# EAGLE schematic frets-main-board2 (EAGLE 6.6.0)
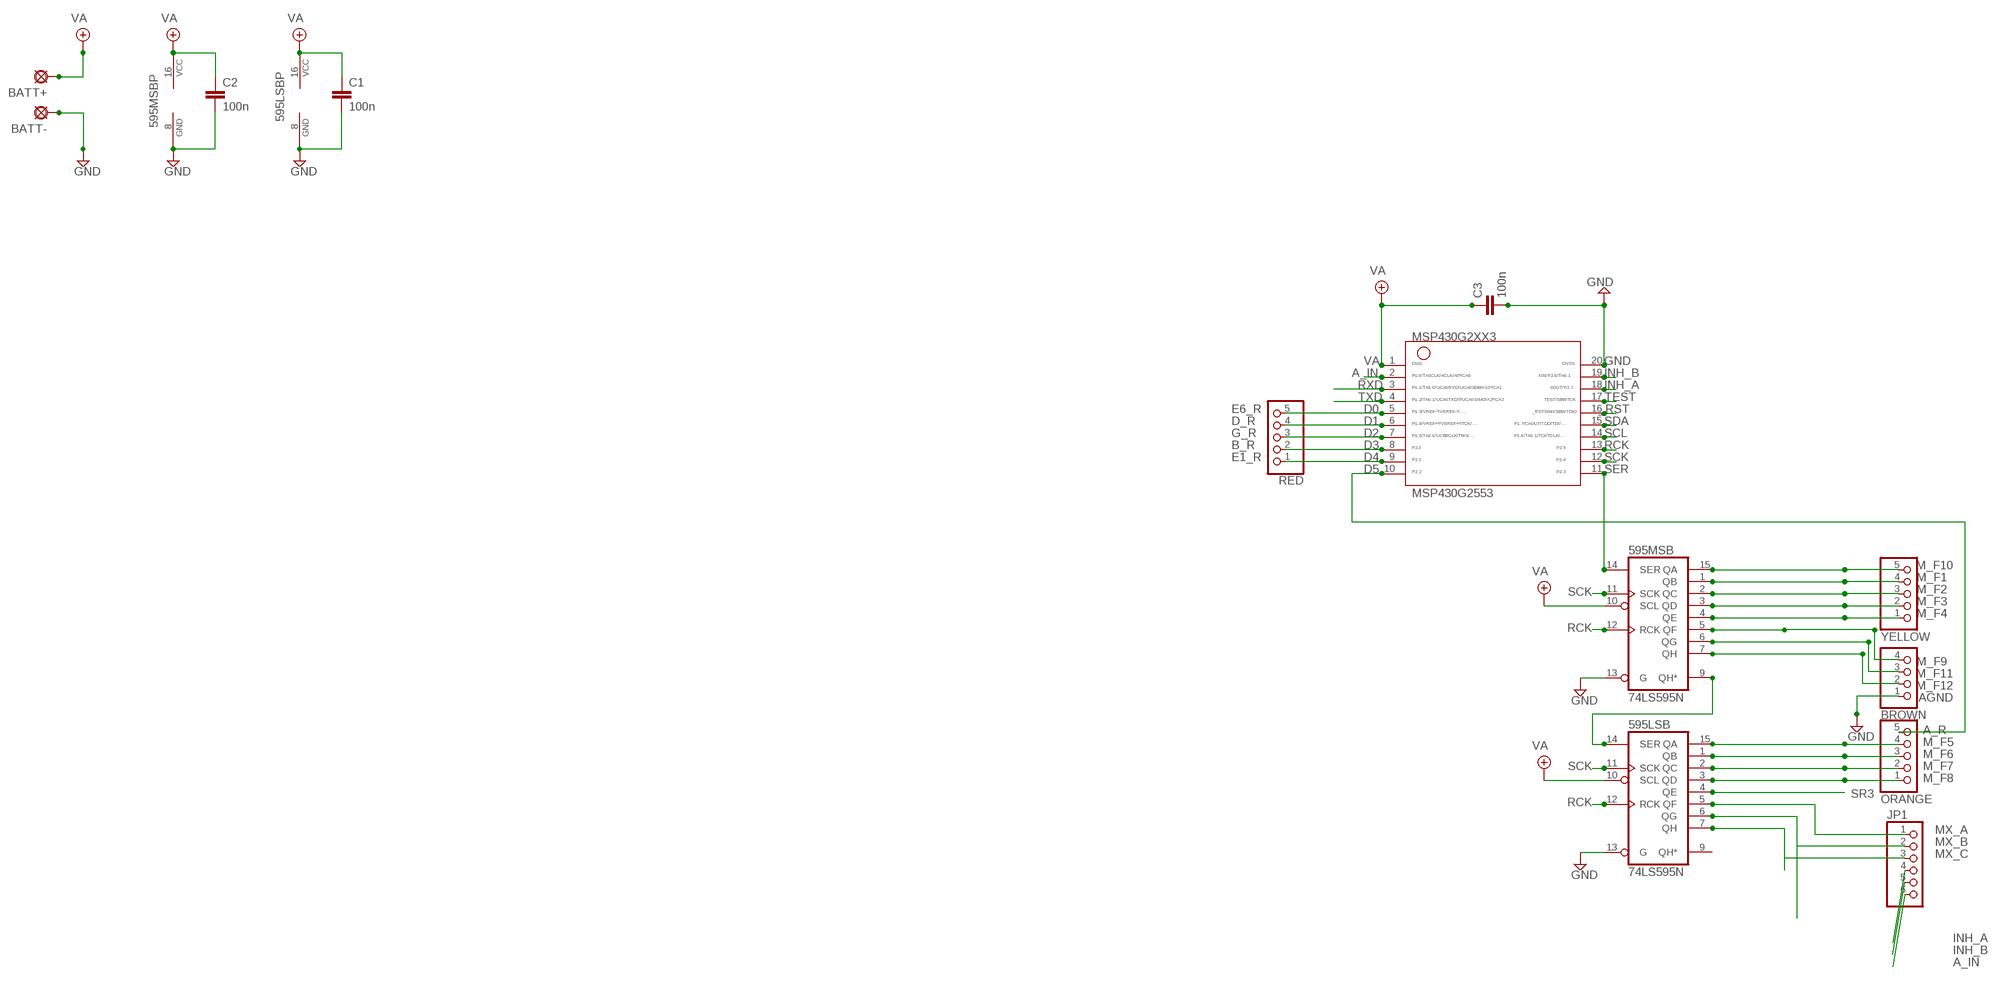
[diagram p0: schematic, sheet 1]

## Parts
595LSB  74LS595N  [DIL16]
595MSB  74LS595N  [DIL16]
BATT+  PADL  [LONG]
BATT-  PADL  [LONG]
BROWN  PINHD-1X4  [1X04]
C1  100n  050X030_050  [050X030_050_3]
C2  100n  050X030_050  [050X030_050_3]
C3  100n  050X030_050  [050X030_050_3]
JP1  PINHD-1X6  [1X06]
MSP430G2553  G2XX3---N20  [N20]
ORANGE  PINHD-1X5  [1X05]
RED  PINHD-1X5  [1X05]
YELLOW  PINHD-1X5  [1X05]

## Nets
_RST: MSP430G2553.16
A_IN: JP1.6 MSP430G2553.2
D0: MSP430G2553.5 RED.5
D1: MSP430G2553.6 RED.4
D2: MSP430G2553.7 RED.3
D3: MSP430G2553.8 RED.2
D4: MSP430G2553.9 RED.1
D5: MSP430G2553.10 ORANGE.5
GND: 595LSB.8(GND) 595LSB.13(G) 595MSB.8(GND) 595MSB.13(G) BATT-.1(PAD) BROWN.1 C1.2 C2.2 C3.2 MSP430G2553.20
INH_A: JP1.4 MSP430G2553.18
INH_B: JP1.5 MSP430G2553.19
MX_A: 595LSB.5(QF) JP1.1
MX_B: 595LSB.6(QG) JP1.2
MX_C: 595LSB.7(QH) JP1.3
N$1: 595LSB.14(SER) 595MSB.9(QH*)
RCK: 595LSB.12(RCK) 595MSB.12(RCK) MSP430G2553.13
RXD: MSP430G2553.3
SCK: 595LSB.11(SCK) 595MSB.11(SCK) MSP430G2553.12
SCL: MSP430G2553.14
SDA: MSP430G2553.15
SER: 595MSB.14(SER) MSP430G2553.11
SR3: 595LSB.4(QE)
SR4: 595LSB.3(QD) ORANGE.1
SR5: 595LSB.2(QC) ORANGE.2
SR6: 595LSB.1(QB) ORANGE.3
SR7: 595LSB.15(QA) ORANGE.4
SR8: 595MSB.7(QH) BROWN.2
SR9: 595MSB.6(QG) BROWN.3
SR10: 595MSB.5(QF) BROWN.4
SR11: 595MSB.4(QE) YELLOW.1
SR12: 595MSB.3(QD) YELLOW.2
SR13: 595MSB.2(QC) YELLOW.3
SR14: 595MSB.1(QB) YELLOW.4
SR15: 595MSB.15(QA) YELLOW.5
TEST: MSP430G2553.17
TXD: MSP430G2553.4
VA: 595LSB.10(SCL) 595LSB.16(VCC) 595MSB.10(SCL) 595MSB.16(VCC) BATT+.1(PAD) C1.1 C2.1 C3.1 MSP430G2553.1
Unconnected: 595LSB.9(QH*)

## Notes on the sheet
- E6_R
- D_R
- G_R
- B_R
- E1_R
- M_F10
- M_F1
- M_F2
- M_F3
- M_F4
- M_F9
- M_F11
- M_F12
- AGND
- A_R
- M_F5
- M_F6
- M_F7
- M_F8

## Library data of the parts
595LSB 595MSB = 74xx-us:74*595: 8-bit SHIFT REGISTER, output latch
BATT+ BATT- = gm-supply:PAD: PAD use this package for pads with any purpose, including input, output, send or return various pad shapes: round, square, octogonal, long, and long offset
BROWN = pinhead:PINHD-1X4: PIN HEADER
C1-C3 = gm-caps-ceramic:050X030_050: 120 - 150pF Xicon Ceramic Disc 5mm lead spacing
JP1 = pinhead:PINHD-1X6: PIN HEADER
MSP430G2553 = TI_MSP430_v16:G2XX3---N20: MSP430G2XX1 PDIP (N) 20 Pin Package
ORANGE RED YELLOW = pinhead:PINHD-1X5: PIN HEADER